# Altium schematic sheet Top.SchDoc
size B
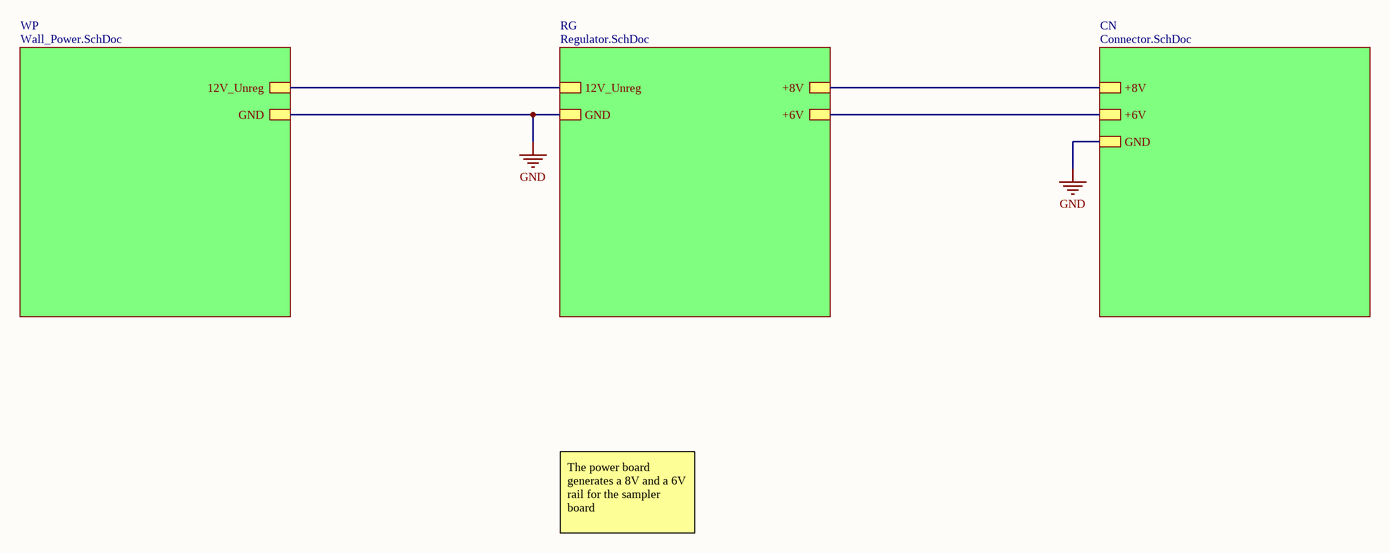
[diagram p0: Top.SchDoc]

## Sub-sheets
CN = Connector.SchDoc: GND, +8V, +6V
RG = Regulator.SchDoc: 12V_Unreg, GND, +8V, +6V
WP = Wall_Power.SchDoc: GND, 12V_Unreg

## Nets
GND: sheet CN/GND, sheet RG/GND, sheet WP/GND
(unnamed): sheet CN/+8V, sheet RG/+8V
(unnamed): sheet CN/+6V, sheet RG/+6V
(unnamed): sheet RG/12V_Unreg, sheet WP/12V_Unreg

## Notes on the sheet
- The power board generates a 8V and a 6V rail for the sampler board